# Altium schematic sheet 06_POWER_1.SchDoc
size 420 x 297 mm; SheetNumber: 7; SheetTotal: 33
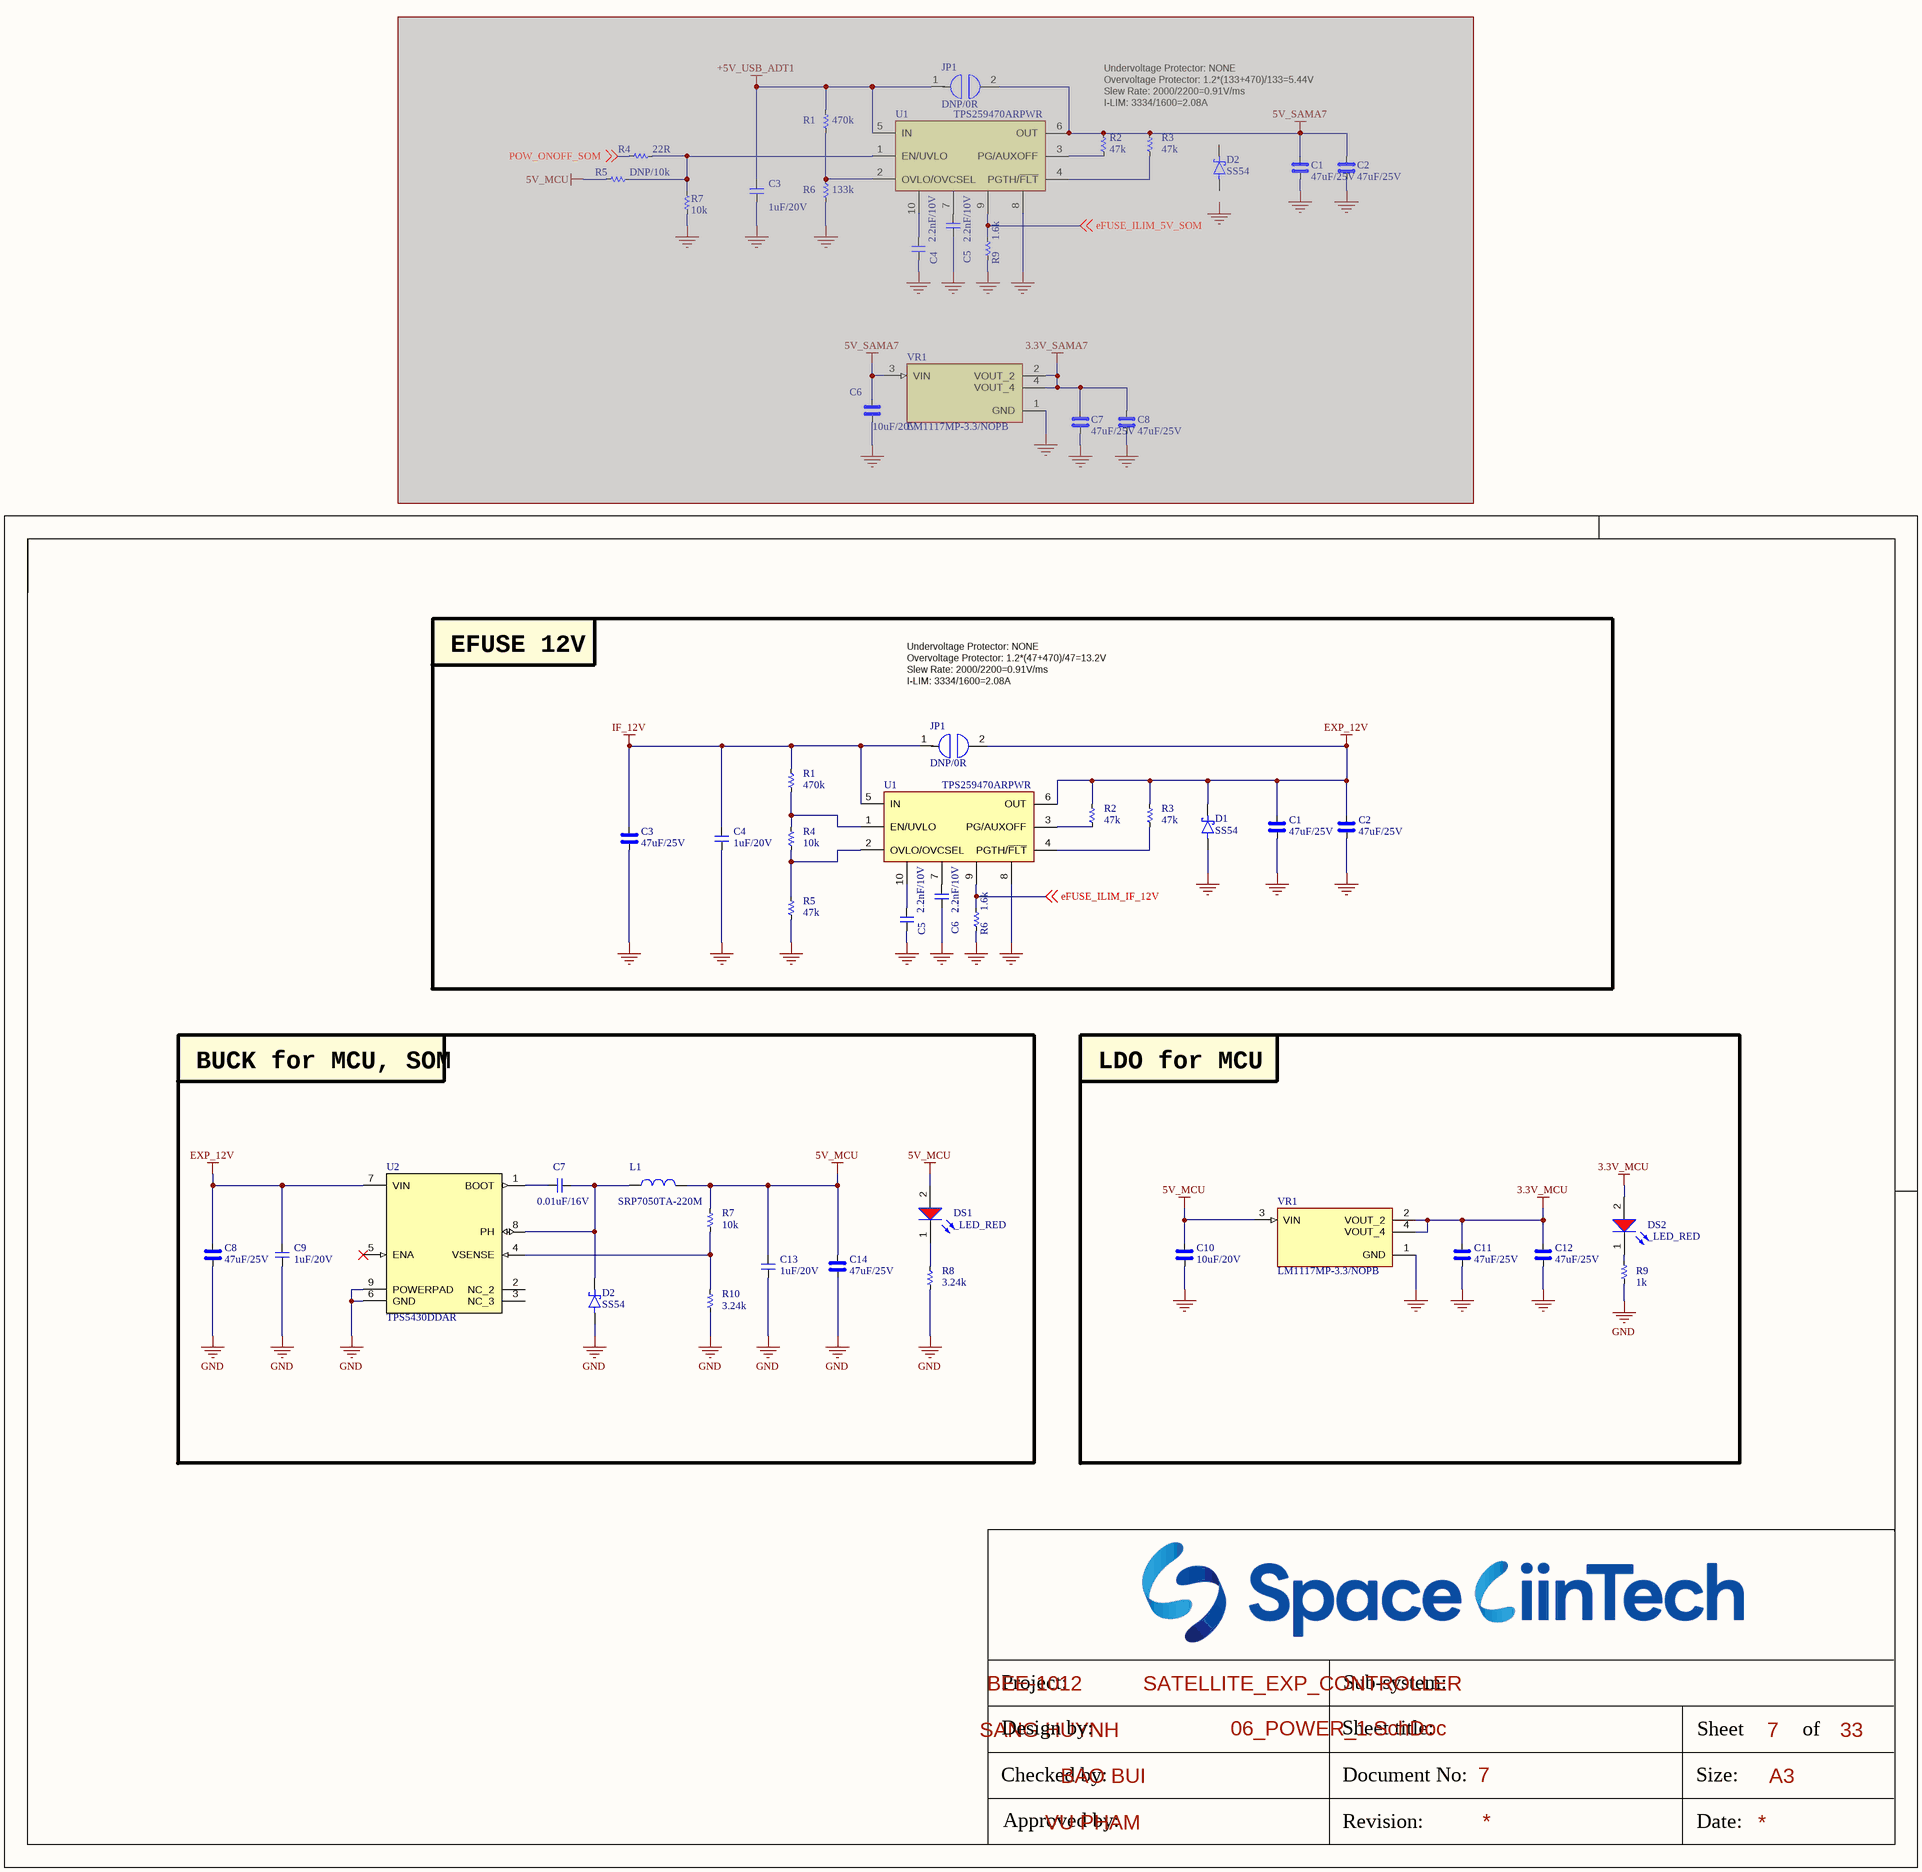
[diagram p0: 06_POWER_1.SchDoc]

## Parts
(Parts that share a designator on the sheet are numbered #1, #2 ... from top to bottom, then left to right.)
C1#1  47uF/25V  [CAP_C_3225X80]  (masked out: inside a compile mask, not in the netlist)
C1#2  47uF/25V  [CAP_C_3225X80]
C2#1  47uF/25V  [CAP_C_3225X80]  (masked out: inside a compile mask, not in the netlist)
C2#2  47uF/25V  [CAP_C_3225X80]
C3#1  1uF/20V  [CAP_C_1005X50_L]  (masked out: inside a compile mask, not in the netlist)
C3#2  47uF/25V  [CAP_C_3225X80]
C4#1  2.2nF/10V  [CAP_C_1005X50_L]  (masked out: inside a compile mask, not in the netlist)
C4#2  1uF/20V  [CAP_C_1005X50_L]
C5#1  2.2nF/10V  [CAP_C_1005X50_L]  (masked out: inside a compile mask, not in the netlist)
C5#2  2.2nF/10V  [CAP_C_1005X50_L]
C6#1  10uF/20V  [CAP_C_2012X110]  (masked out: inside a compile mask, not in the netlist)
C6#2  2.2nF/10V  [CAP_C_1005X50_L]
C7#1  47uF/25V  [CAP_C_3225X80]  (masked out: inside a compile mask, not in the netlist)
C7#2  0.01uF/16V  [CAP_C_1608X80]
C8#1  47uF/25V  [CAP_C_3225X80]  (masked out: inside a compile mask, not in the netlist)
C8#2  47uF/25V  [CAP_C_3225X80]
C9  1uF/20V  [CAP_C_1005X50_L]
C10  10uF/20V  [CAP_C_2012X110]
C11  47uF/25V  [CAP_C_3225X80]
C12  47uF/25V  [CAP_C_3225X80]
C13  1uF/20V  [CAP_C_1005X50_L]
C14  47uF/25V  [CAP_C_3225X80]
D1  SS54  [DO-214AC_SMA]
D2#1  SS54  [DO-214AC_SMA]  (masked out: inside a compile mask, not in the netlist)
D2#2  SS54  [DO-214AC_SMA]
DS1  _LED_RED  [LED_0402]
DS2  _LED_RED  [LED_0402]
JP1#1  DNP/0R  [JUMPER_1608]  (masked out: inside a compile mask, not in the netlist)
JP1#2  DNP/0R  [JUMPER_1608]
L1  SRP7050TA-220M  [PSM6050]
R1#1  470k  [RES_C_1005x30_L]  (masked out: inside a compile mask, not in the netlist)
R1#2  470k  [RES_C_1005x30_L]
R2#1  47k  [RES_C_1005x30_L]  (masked out: inside a compile mask, not in the netlist)
R2#2  47k  [RES_C_1005x30_L]
R3#1  47k  [RES_C_1005x30_L]  (masked out: inside a compile mask, not in the netlist)
R3#2  47k  [RES_C_1005x30_L]
R4#1  22R  [RES_C_1005x30_L]  (masked out: inside a compile mask, not in the netlist)
R4#2  10k  [RES_C_1005x30_L]
R5#1  DNP/10k  [RES_C_1005x30_L]  (masked out: inside a compile mask, not in the netlist)
R5#2  47k  [RES_C_1005x30_L]
R6#1  133k  [RES_C_1005x30_L]  (masked out: inside a compile mask, not in the netlist)
R6#2  1.6k  [RES_C_1005x30_L]
R7#1  10k  [RES_C_1005x30_L]  (masked out: inside a compile mask, not in the netlist)
R7#2  10k  [RES_C_1005x30_L]
R8  3.24k  [RES_C_1005x30_L]
R9#1  1.6k  [RES_C_1005x30_L]  (masked out: inside a compile mask, not in the netlist)
R9#2  1k  [RES_C_1005x30_L]
R10  3.24k  [RES_C_1005x30_L]
U1#1  TPS259470ARPWR  [VQFN-HR-10]  (masked out: inside a compile mask, not in the netlist)
U1#2  TPS259470ARPWR  [VQFN-HR-10]
U2  TPS5430DDAR  [TPS5430DDAR_V3]
VR1#1  LM1117MP-3.3/NOPB  [VREG_LM1117MP-3.3/NOPB]  (masked out: inside a compile mask, not in the netlist)
VR1#2  LM1117MP-3.3/NOPB  [VREG_LM1117MP-3.3/NOPB]

## Blocks framed on the sheet
EFUSE 12V: C1#2 C2#2 C3#2 C4#2 C5#2 C6#2 D1 JP1#2 R1#2 R2#2 R3#2 R4#2 R5#2 R6#2 U1#2
BUCK for MCU, SOM: C7#2 C8#2 C9 C13 C14 D2#2 DS1 L1 R7#2 R8 R10 U2
LDO for MCU: C10-C12 DS2 R9#2 VR1#2

## Nets
3.3V_MCU: C11.2 C12.2 DS2.2(A) VR1#2.2(VOUT_2) VR1#2.4(VOUT_4)
5V_MCU: C10.1 C13.2 C14.2 DS1.2(A) L1.2 R7#2.2 VR1#2.3(VIN)
EXP_12V: C1#2.2 C2#2.2 C8#2.2 C9.2 D1.1(K) JP1#2.2 R2#2.2 R3#2.2 U1#2.6(OUT) U2.7(VIN)
GND: C1#2.1 C2#2.1 C3#2.1 C4#2.1 C5#2.1 C6#2.1 C8#2.1 C9.1 C10.2 C11.1 C12.1 C13.1 C14.1 D1.2(A) D2#2.2(A) R5#2.1 R6#2.1 R8.1 R9#2.1 R10.1 U1#2.8 U2.6(GND) U2.9(POWERPAD) VR1#2.1(GND)
IF_12V: C3#2.2 C4#2.2 JP1#2.1 R1#2.2 U1#2.5(IN)
eFUSE_ILIM_IF_12V: R6#2.2 U1#2.9 ; off-sheet eFUSE_ILIM_IF_12V
NetC5#2_2: C5#2.2 U1#2.10
NetC6#2_2: C6#2.2 U1#2.7
NetC7#2_1: C7#2.1 D2#2.1(K) L1.1 U2.8(PH)
NetC7#2_2: C7#2.2 U2.1(BOOT)
NetDS1_1: DS1.1(K) R8.2
NetDS2_1: DS2.1(K) R9#2.2
NetR1#2_1: R1#2.1 R4#2.1 U1#2.1(EN/UVLO)
NetR2#2_1: R2#2.1 U1#2.3(PG/AUXOFF)
NetR3#2_1: R3#2.1 U1#2.4(PGTH/~{FLT})
NetR4#2_2: R4#2.2 R5#2.2 U1#2.2(OVLO/OVCSEL)
NetR7#2_1: R7#2.1 R10.2 U2.4(VSENSE)

Not connected (* = marked no-connect by the designer): U2 2(NC_2) 3(NC_3) 5(ENA)*

## Notes on the sheet
- Undervoltage Protector: NONE
- Overvoltage Protector: 1.2*(133+470)/133=5.44V
- Slew Rate: 2000/2200=0.91V/ms
- I-LIM: 3334/1600=2.08A
- Overvoltage Protector: 1.2*(47+470)/47=13.2V
- Project:
- BEE-1012
- Sub-system:
- SATELLITE_EXP_CONTROLLER
- Design by:
- SANG HUYNH
- BAO BUI
- Sheet title:
- Sheet
- A3
- of
- Checked by:
- Approved by:
- VU PHAM
- Revision:
- Document No:
- Size:
- Date:

## Library data of the parts
C1#1 C1#2 C2#1 C2#2 C3#2 C6#1 C7#1 C8#1 C8#2 C10-C12 C14 = _CAP_C_High_2: CAP High Value
C3#1 C4#1 C4#2 C5#1 C5#2 C6#2 C7#2 C9 C13 = _CAP_C_2: CAP
D1 D2#1 D2#2 = DIODE SCHOTTKY
JP1#1 JP1#2 = JUMPER
L1 = SRP7050TA-220M: FIXED IND 22UH 2.5A 170 MOHM SMD
R1#1 R1#2 R2#1 R2#2 R3#1 R3#2 R4#1 R4#2 R5#1 R5#2 R6#1 R6#2 R7#1 R7#2 R8 R9#1 R9#2 R10 = _RES_B_2: RES
U2 = TPS5430DDAR: IC REG BUCK ADJ 3A 8SOPWR
VR1#1 VR1#2 = LM1117MP-3.3/NOPB: 800-mA 15-V linear voltage regulator; MF: Texas Instruments; SnapEDA_Link: https://www.snapeda.com/parts/LM1117MP-3.3/NOPB/Texas+Instruments/view-part/?ref=snap; Package: SOT-223-4 Texas Instruments; Value: *; MP: LM1117MP-3.3/NOPB; Check_prices: https://www.snapeda.com/parts/LM1117MP-3.3/NOPB/Texas+Instruments/view-part/?ref=eda